# EasyEDA Pro project ProPrj_继电器_2024-08-31.epro

# Board PCB1
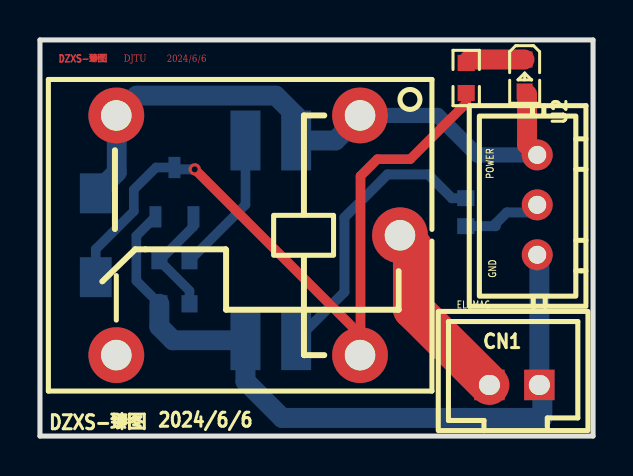
[diagram p0: board, top side]
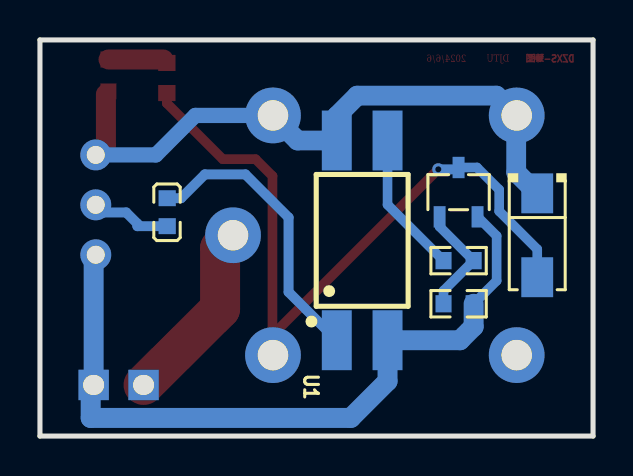
[diagram p1: board, bottom side, seen from below]

Outline 27.69 x 19.83 mm; copper layers: Top Layer, Bottom Layer. Coordinates in mm from the lower left corner of the outline.
Outline path: 0,19.83 27.69,19.83 27.69,0 0,0 0,19.83
Stack: Top Layer 0.035mm / Dielectric1 1.51mm FR4 er 4.5 / Bottom Layer 0.035mm

## Design rules (mm)
template: JLCPCB Capability(Two Layers Board)
spacing copperThickness1oz (default): track to track 0.102, other pairs 0.152 to 0.3
spacing copperThickness2oz: track to track 0.203, other pairs 0.152 to 0.3
track width copperThickness1oz (default): min 0.127, default 0.254, max 2.54
track width copperThickness2oz: min 0.203, default 0.254, max 2.54
differential pair differentialPair (default): width min 0.127, default 0.254, max 2.54; gap min 0.152, default 0.152
via viaSize (default): diameter min 0.5, default 0.61, max 10; hole min 0.3, default 0.305, max 6.3

## Placement (name value [footprint] x y rotation side)
CN1  WAFER-XH2.54-2PZZ  [CONN-TH_XH2.54-2P]  23.75 2.56 0 top
D1  SS12  [SMA_L4.3-W2.5-LS5.0-RD]  2.79 10.05 270 bottom
L1  BLM18AG601SN1D  [L0603]  21.32 11.21 90 bottom
LED1  NCD0603R1  [LED0603-RD_RED]  24.26 18.05 270 top
Q1  S8050  [SOT-23-3_L2.9-W1.6-P1.90-LS2.8-BR]  6.73 12.21 270 bottom
R1  1K  [R0603]  6.73 8.78 180 bottom
R2  10K  [R0603]  6.73 6.62 0 bottom
R3  5.1K  [R0603]  21.34 17.93 90 top
RLY1  SRD-05VDC-SL-C  [RELAY-TH_SRD-XXVDC-XL-C]  10.92 10.05 180 top
U1  PC817C  [OPTO-SMD-4_L4.6-W6.5-P2.54-LS10.3-TL]  11.56 9.8 90 bottom
U2  B3B-XH-A(LF)(SN)  [CONN-TH_3P-P2.50_A2501WV2-3P]  24.89 11.58 270 top

## Footprints (pads in the part's own frame, mm; a bottom-side part is the same pattern mirrored in y, then rotated)
CONN-TH_3P-P2.50_A2501WV2-3P
  round 1.55 hole 0.9: 1(-2.5,0) 2(0,0) 3(2.5,0)
CONN-TH_XH2.54-2P
  rect 1.524x1.524 hole 1.05x1: 1(-1.25,0) 2(1.25,0)
L0603
  rect 0.8x0.864 smd: 1(-0.7,0) 2(0.7,0)
LED0603-RD_RED
  rect 0.8x0.8 smd: 1(-0.799,-0.004) 2(0.799,0.004)
OPTO-SMD-4_L4.6-W6.5-P2.54-LS10.3-TL
  rect 3x1.5 smd: 1(-5,1.27) 2(-5,-1.27) 3(5,-1.27) 4(5,1.27)
R0603
  rect 0.806x0.864 smd: 1(-0.753,0) 2(0.753,0)
RELAY-TH_SRD-XXVDC-XL-C
  round 2.794 hole 1.524: 1(-5.1,-6) 2(7.1,-6) 3(7.1,6) 4(-5.1,6) 5(-7.1,0)
SMA_L4.3-W2.5-LS5.0-RD
  rect 2x1.593 smd: 1(-2.1,0) 2(2.1,0)
SOT-23-3_L2.9-W1.6-P1.90-LS2.8-BR
  rect 1.07x0.6 smd: 1(1.235,-0.95) 2(1.235,0.95) 3(-1.235,0)

## Nets
GND: CN1.2 Q1.2 R2.1 U1.2 U2.3
ELEMAG: CN1.1 RLY1.5
POWER: D1.1 LED1.2 RLY1.1 RLY1.2 U1.4 U2.1
$1N132: L1.1 U2.2
$1N294: L1.2 U1.1
$1N449: R1.1 U1.3
$1N533: Q1.1 R1.2 R2.2
$1N683: LED1.1 R3.2
$1N728: D1.2 Q1.3 R3.1 RLY1.4

Pads without a net: RLY1 3

## Via types
v1: diameter 0.61, hole 0.305, Top Layer to Bottom Layer, 1 via

## Routing (per net, layer and track width the routed paths; a pad name or vN(x,y) marks a point on that pad's centre or on a via; arc(x,y) is an arc through that point)
GND: length 36.9
  Bottom Layer w0.482: Q1.2 4.83,10.02 4.83,7.77 R2.1
  Bottom Layer w1: R2.1 5.98,5.48 6.66,4.8 U1.2 10.29,2.75 12.13,0.91 25.15,0.91 25.15,2.41 CN1.2 25,8.97 U2.3
ELEMAG: length 9.4
  Top Layer w2: CN1.1 18.67,6.37 18.67,9.4 RLY1.5
POWER: length 32
  Top Layer w1: U2.1 24.38,14.58 24.38,17.11
  Bottom Layer w0.762: U2.1 21.88,14.08 19.91,16.05 16.05,16.05
  Bottom Layer w0.991: 16.05,16.05 14.79,14.8 U1.4 12.83,16.02 11.81,17.04 4.84,17.04 3.85,16.05 3.85,13.2 D1.1
$1N132: length 4.1
  Bottom Layer w0.5: U2.2 24.51,11.19 23.37,11.19 22.81,10.63 22.81,10.51 L1.1
$1N294: length 14.6
  Bottom Layer w0.5: L1.2 20.62,11.91 19.43,13.1 17.4,13.1 15.24,10.94 15.24,7.21 U1.1
$1N449: length 7.2
  Bottom Layer w0.482: R1.1 10.29,11.58 U1.3
$1N533: length 5.7
  Bottom Layer w0.482: Q1.1 7.68,10.48 R1.2 7.48,7.27 R2.2
$1N683: length 2.7
  Top Layer w1: 21.51,18.85 LED1.1
$1N728: length 36.7
  Top Layer w0.482: 16.05,5.05 16.05,13.02 16.89,13.86 18.53,13.86 21.34,16.66 R3.1 ; 16.05,5.05 v1(7.75,13.35) ; 16.05,5.05 16.05,4.05
  Bottom Layer w0.482: Q1.3 5.81,13.45 4.7,12.34 4.7,11.26 2.79,9.35 D1.2
  Bottom Layer w0.5: Q1.3 6.82,13.35 v1(7.75,13.35)

## Text on the board
Top Layer: DZXS-臻图 | DJTU | 2024/6/6
Top Silkscreen Layer: ELEMAG | POWER | GND | 2024/6/6 | DZXS-臻图
